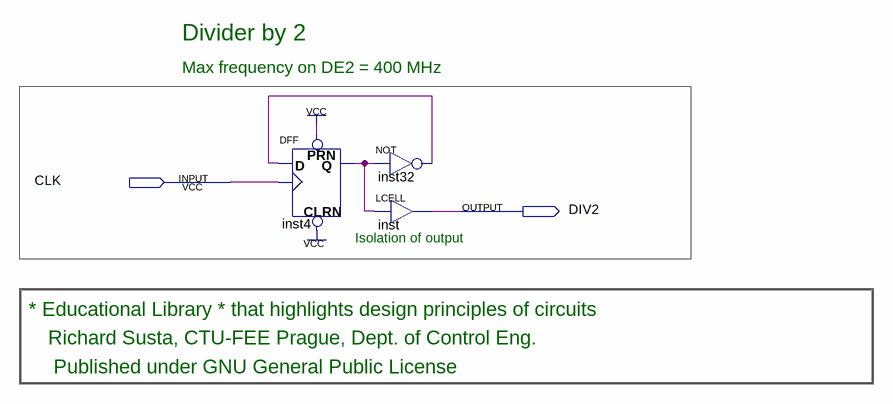
[diagram p0: schematic sheet]
// Quartus schematic divider2.bdf as structural Verilog: 3 symbols, 2 pins
module divider2 (
  input  CLK,
  output DIV2
);

  wire inst4_q, inst32_out;

  DFF inst4 (.CLRN(1'b1), .CLK(CLK), .D(inst32_out), .PRN(1'b1), .Q(inst4_q));
  not inst32 (inst32_out, inst4_q);
  LCELL inst (.IN(inst4_q), .OUT(DIV2));

  // Notes on the sheet:
  //   Divider by 2
  //   Max frequency on DE2 = 400 MHz
  //   Isolation of output
  //   * Educational Library * that highlights design principles of circuits
  //   Richard Susta, CTU-FEE Prague, Dept. of Control Eng. 
  //    Published under GNU General Public License
endmodule
